# EasyEDA Pro project busmaster-v101.eprj, schematic bus-board
Board Name: bus-board; Create Date: 2025-11-23; Page Name: P1; Project Name: busmaster-v101; Schematic Name: bus-board; Update Date: 2025-11-23; Company: EasyEDA.com; Page Size: A4; Version: V1.0
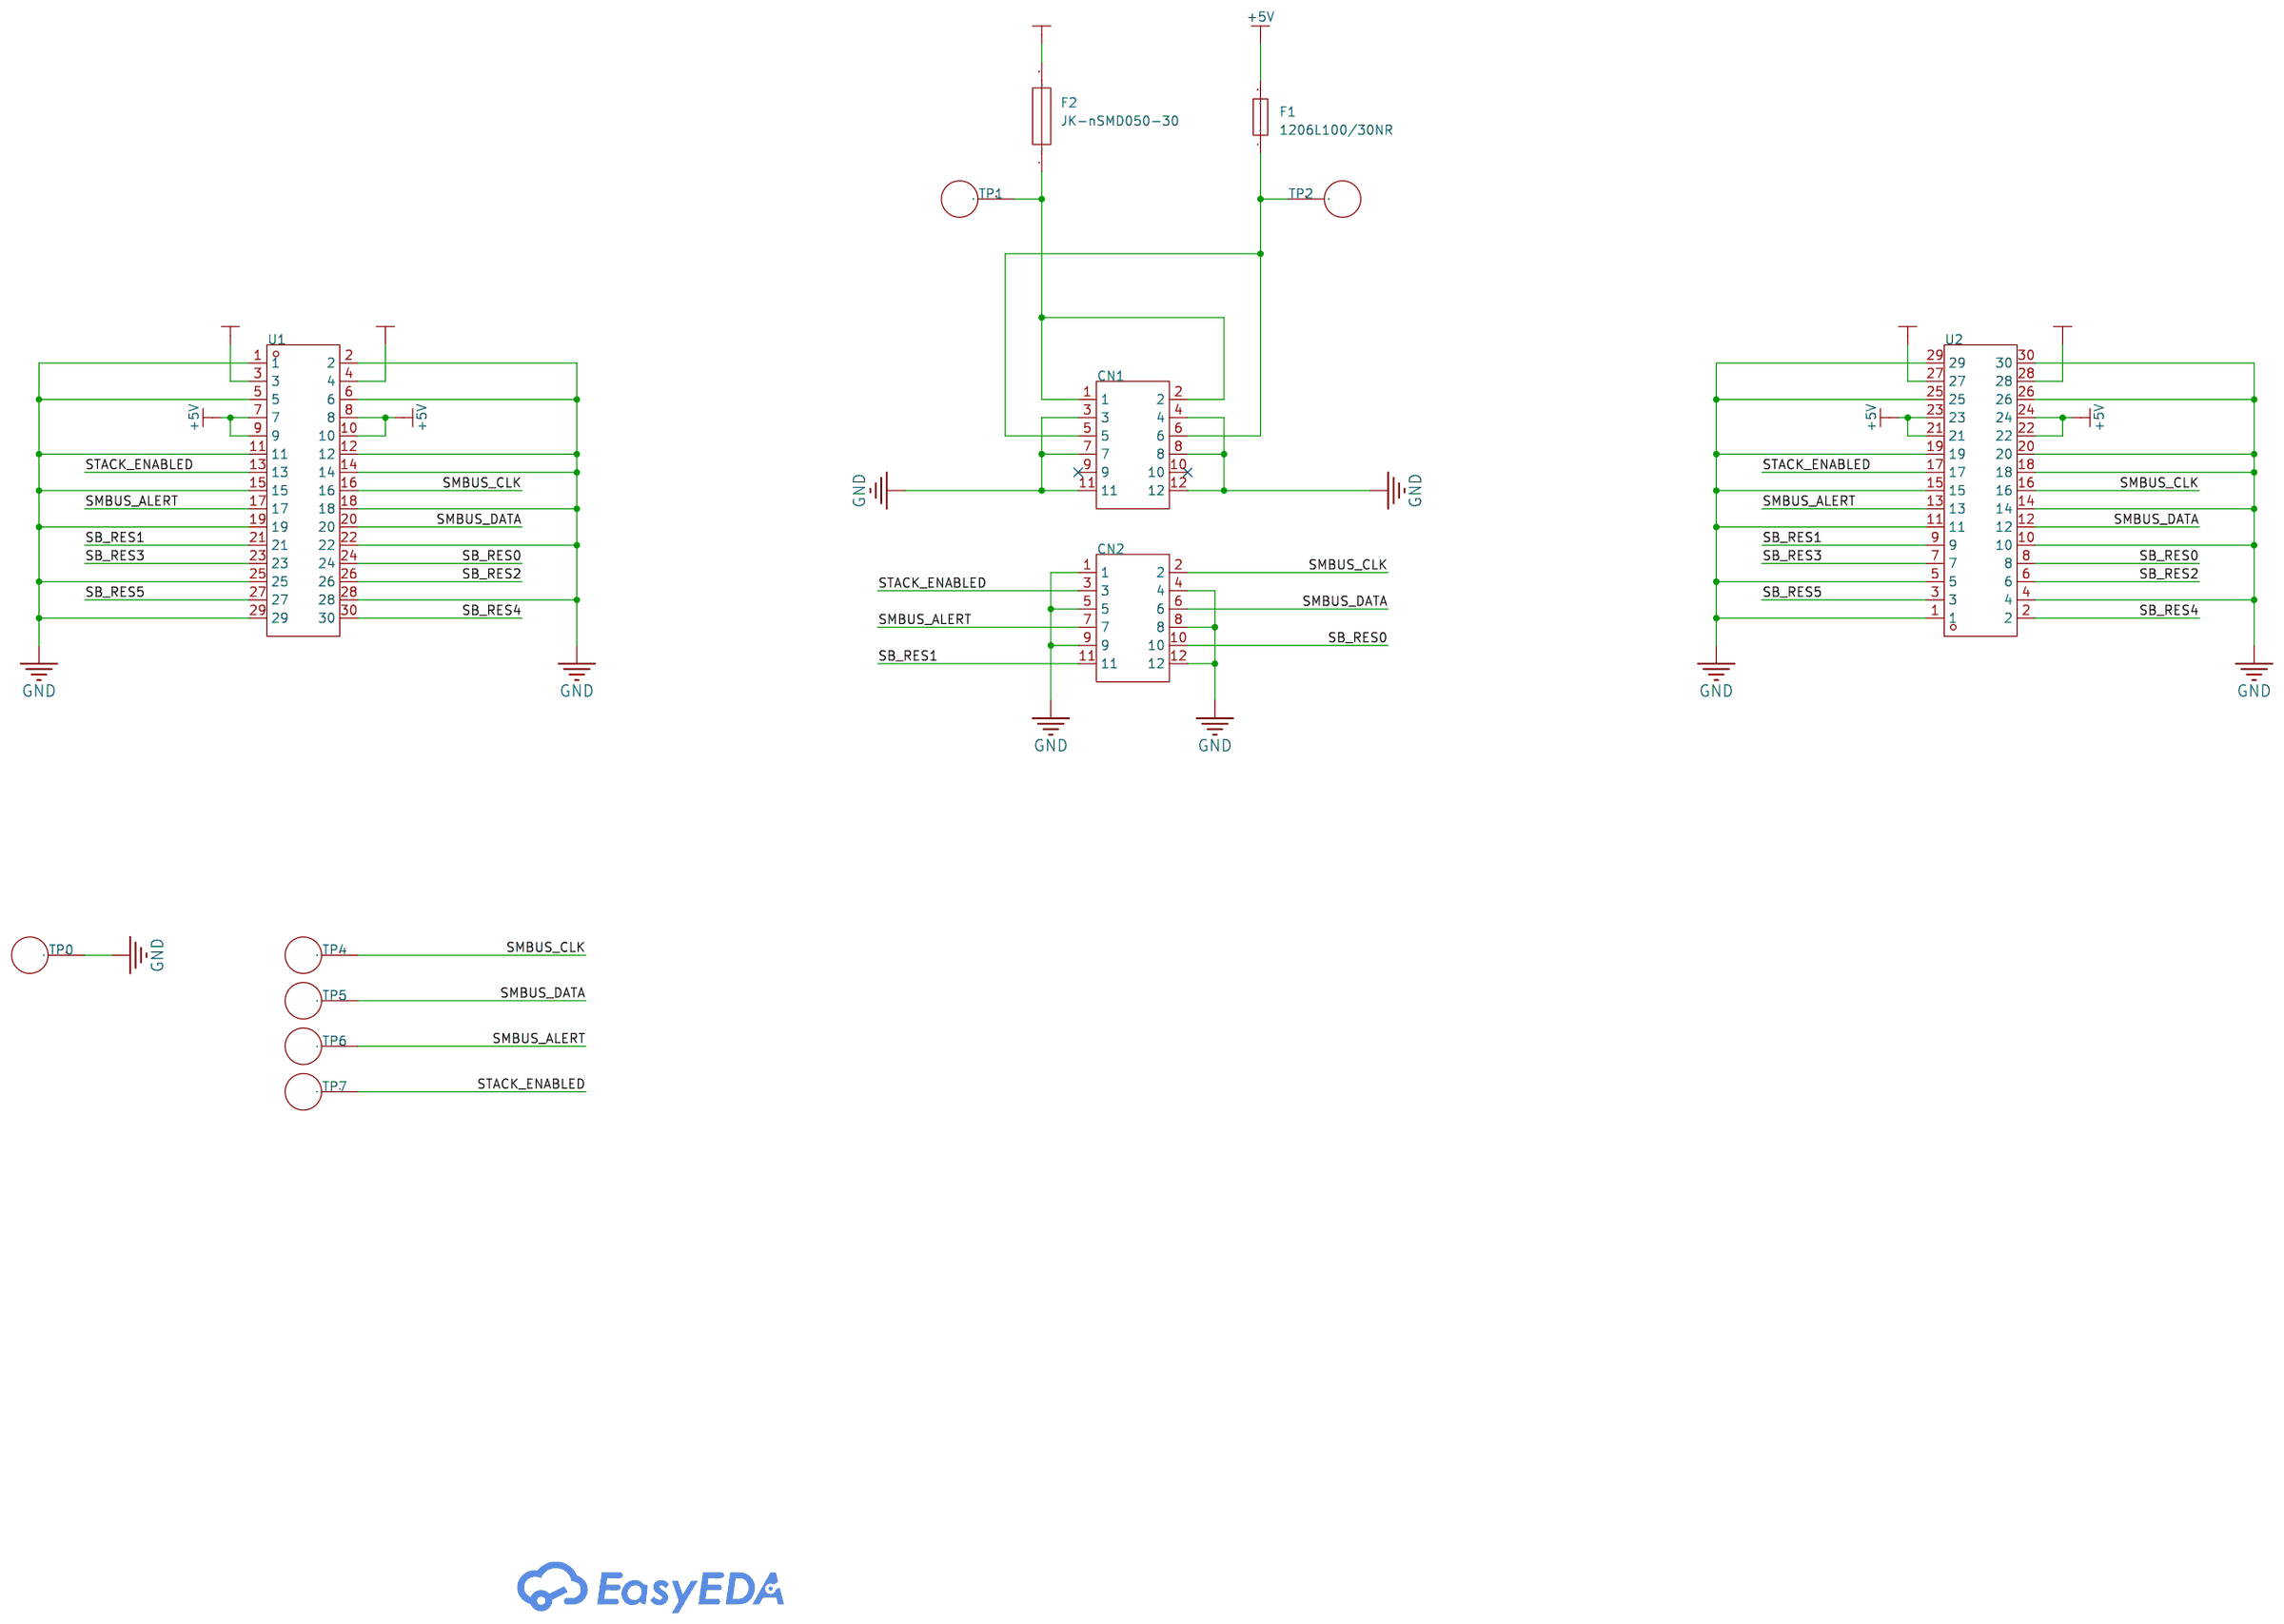
[diagram p3: schematic sheet]

## Parts
CN1  PH2.0-01-06PZS  [HDR-TH_12P-P2.00-V-M-R2-C6-S2.00]
CN2  PH2.0-01-06PZS  [HDR-TH_12P-P2.00-V-M-R2-C6-S2.00]
F1  1206L100/30NR  [F1206]
F2  JK-nSMD050-30  [F1206]
TP0  RH-5004  [TESTPOINT_TH_BD2.5-D1.2]
TP1  RH-5004  [TESTPOINT_TH_BD2.5-D1.2]
TP2  RH-5004  [TESTPOINT_TH_BD2.5-D1.2]
TP4  RH-5004  [TESTPOINT_TH_BD2.5-D1.2]
TP5  RH-5004  [TESTPOINT_TH_BD2.5-D1.2]
TP6  RH-5004  [TESTPOINT_TH_BD2.5-D1.2]
TP7  RH-5004  [TESTPOINT_TH_BD2.5-D1.2]
U1  XDZ254-2-15-W-2.5-G1  [HDR-TH_30P-P2.54-H-M-R2-C15-S2.54-N]
U2  PM254-2-15-W-8.5  [HDR-TH_30P-P2.54-H-F-R2-C15-W8.5]

## Library data of the parts
CN1 CN2 = PH2.0-01-06PZS: Pin Structure:2x6P Pitch:2mm Row Spacing:2mm Circluar Pins/Square Pins:Pin Header Mounting Type:Through Hole Number of Rows:2 Number of Pins:12P Current Rating:1.5A Length of Mating Pin:3.9mm Insulation Height:2mm Length of End Connection Pin:2.8mm Contac; LCSC Part Name: 2x6P 间距:2mm 方针 直插; Supplier Part: C49286580; Manufacturer: XUNPU(讯普); Supplier Footprint: 插件,P=2mm; JLCPCB Part Class: Extended Part; Datasheet: https://item.szlcsc.com/datasheet/PH2.0-01-06PZS/51736339.html; Supplier: LCSC; Pin Structure: 2x6P; Pitch: 2mm; Row Spacing: 2mm; Circluar Pins/Square Pins: Pin Header; Mounting Type: Through Hole; Number of Rows: 2; Number of Pins: 12P; Current Rating: 1.5A; Length of Mating Pin: 3.9mm; Insulation Height: 2mm; Length of End Connection Pin: 2.8mm; Contact Material: Brass; Contact Plating: Gold; Operating Temperature: -40℃~+105℃; Color: Black
F1 = 1206L100/30NR: Operating Voltage (Max):30V Current Rating (Max):40A Hold Current:1A Trip Current:1.8A Power Dissipation:1.2W Resistance - Initial (Ri) (Min):50mΩ Resistance - Post Trip (R1) (Max):300mΩ Maximum Time to Trip:300ms Operating Temperature:-40℃~+85℃ Operating; LCSC Part Name: 30V 1A 1206自恢复; Supplier Part: C7542958; Manufacturer: LUTE(陆特); Supplier Footprint: 1206; JLCPCB Part Class: Extended Part; Datasheet: https://atta.szlcsc.com/upload/public/pdf/source/20230822/76048F24A79812F12BF570E3FD18C816.pdf; Supplier: LCSC; Operating Voltage (Max): 30V; Current Rating (Max): 40A; Hold Current: 1A; Trip Current: 1.8A; Power Dissipation: 1.2W; Resistance - Initial (Ri) (Min): 50mΩ; Resistance - Post Trip (R1) (Max): 300mΩ; Maximum Time to Trip: 300ms; Operating Temperature: -40℃~+85℃
F2 = JK-nSMD050-30: Voltage - Max:30V Current - Max:100A Hold Current:500mA Trip Current:1A Power Dissipation:600mW Resistance - Initial (Ri) (Min):150mΩ Resistance - Post Trip (R1) (Max):300mΩ Time to Trip(Max):100ms Operating Temperature:-40℃~+85℃ Operating Temperature:-40; LCSC Part Name: 30V 500mA 1206自恢复; Supplier Part: C720075; Manufacturer: JK(金科); Supplier Footprint: 1206; JLCPCB Part Class: Extended Part; Datasheet: https://item.szlcsc.com/datasheet/JK-nSMD050-30/764095.html; Supplier: LCSC; Voltage - Max: 30V; Current - Max: 100A; Hold Current: 500mA; Trip Current: 1A; Power Dissipation: 600mW; Resistance - Initial (Ri) (Min): 150mΩ; Resistance - Post Trip (R1) (Max): 300mΩ; Time to Trip(Max): 100ms; Operating Temperature: -40℃~+85℃; Length: 3.5mm; Width: 1.8mm; Height: 1.2mm
TP0-TP2 TP4-TP7 = RH-5004: Connector Type:Pin type (through board) Plastic Color:Yellow Board Space (Diameter φ/ Length x Width):2.5mm; LCSC Part Name: PCB电路板测试点/测试针; Supplier Part: C5199804; Manufacturer: 荣和; JLCPCB Part Class: Extended Part; Supplier: LCSC; Connector Type: Pin type (through board); Plastic Color: Yellow; Board Space (Diameter φ/ Length x Width): 2.5mm
U1 = XDZ254-2-15-W-2.5-G1: Pin Structure:2x15P Pitch:2.54mm Circluar Pins/Square Pins:Pin Header Mounting Type:Right Angle Number of Rows:2 Number of Pins:30P Current Rating:3A Length of Mating Pin:6mm Insulation Height:2.5mm Length of End Connection Pin:3mm Operating Temperature:-; LCSC Part Name: 2x15P 间距:2.54mm 方针 弯插; Supplier Part: C18905913; Manufacturer: XUNDA(讯答); Supplier Footprint: 弯插,P=2.54mm; JLCPCB Part Class: Extended Part; Datasheet: https://item.szlcsc.com/datasheet/XDZ254-2-15-W-2.5-G1/20100617.html; Supplier: LCSC; Pin Structure: 2x15P; Pitch: 2.54mm; Circluar Pins/Square Pins: Pin Header; Mounting Type: Right Angle; Number of Rows: 2; Number of Pins: 30P; Current Rating: 3A; Length of Mating Pin: 6mm; Insulation Height: 2.5mm; Length of End Connection Pin: 3mm; Operating Temperature: -40℃~+105℃; Color: Black
U2 = PM254-2-15-W-8.5: LCSC Part Name: 2x15P 间距:2.54mm 弯插; Supplier Part: C2897435; Manufacturer: HCTL(华灿天禄); Supplier Footprint: 弯插,P=2.54mm; JLCPCB Part Class: Extended Part; Datasheet: https://item.szlcsc.com/datasheet/PM254-2-15-W-8.5/3142440.html; Supplier: LCSC; Holes Structure: 2x15P; Pitch: 2.54mm; Row Spacing: 2.54mm; Circular Hole / Square Hole: Square Hole; Mounting Type: Right Angle; Number of Rows: 2; Number of Positions: 30P; Current Rating: 3A; Holes Direction: Side; Insulation Height: 8.5mm; Contact Material: Copper Alloy; Operating Temperature: -40℃~+105℃

## Nets
+5V: F1.2 U1.7 U1.8 U1.9 U1.10 U2.21 U2.22 U2.23 U2.24
+12V: F2.2 U1.3 U1.4 U2.27 U2.28
GND: CN1.3 CN1.4 CN1.7 CN1.8 CN1.11 CN1.12 CN2.1 CN2.4 CN2.5 CN2.8 CN2.9 CN2.12 TP0.1 U1.1 U1.2 U1.5 U1.6 U1.11 U1.12 U1.14 U1.15 U1.18 U1.19 U1.22 U1.25 U1.28 U1.29 U2.1 U2.4 U2.5 U2.10 U2.11 U2.14 U2.15 U2.18 U2.19 U2.20 U2.25 U2.26 U2.29 U2.30
SB_RES0: CN2.10 U1.24 U2.8
SB_RES1: CN2.11 U1.21 U2.9
SB_RES2: U1.26 U2.6
SB_RES3: U1.23 U2.7
SB_RES4: U1.30 U2.2
SB_RES5: U1.27 U2.3
SMBUS_ALERT: CN2.7 TP6.1 U1.17 U2.13
SMBUS_CLK: CN2.2 TP4.1 U1.16 U2.16
SMBUS_DATA: CN2.6 TP5.1 U1.20 U2.12
STACK_ENABLED: CN2.3 TP7.1 U1.13 U2.17
$1N3146: CN1.1 CN1.2 F2.1 TP1.1
$1N3154: CN1.5 CN1.6 F1.1 TP2.1

Not connected (* = marked no-connect by the designer): CN1 9* 10*
